# EAGLE design resonant-bpf-rev3 (EAGLE 7.7.0)
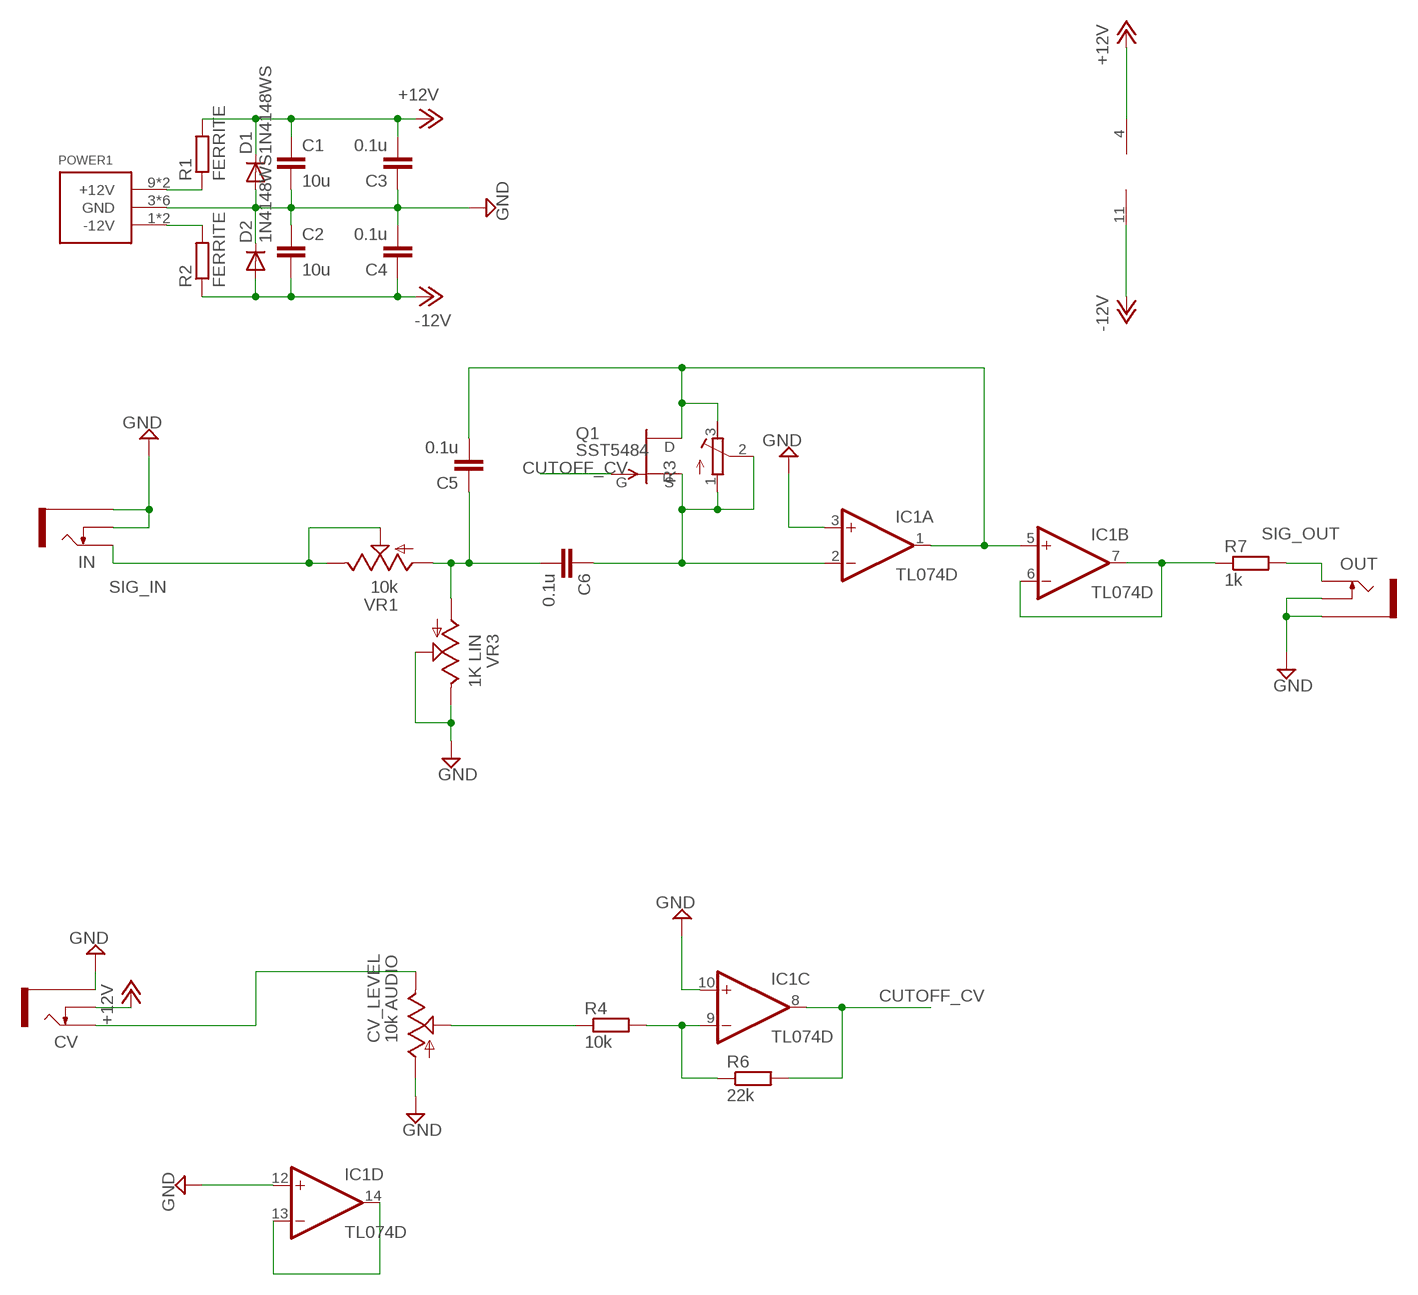
[diagram p0: schematic, sheet 1]

## Parts
C1  10u  C-EUC0805  [C0805]
C2  10u  C-EUC0805  [C0805]
C3  0.1u  C-EUC0805  [C0805]
C4  0.1u  C-EUC0805  [C0805]
C5  0.1u  C-EUC0805  [C0805]
C6  0.1u  C-EUC0805  [C0805]
CV  THONKICONNNEW  [WQP-PJ301M-12_JACK]
CV_LEVEL  10k AUDIO  9MM_SNAP-IN_POT_  [9MM_SNAP-IN_POT]
D1  1N4148WS  DIODE-SOD323-W  [SOD323-W]
D2  1N4148WS  DIODE-SOD323-W  [SOD323-W]
IC1  TL074D  [SO14]
IN  THONKICONNNEW  [WQP-PJ301M-12_JACK]
OUT  THONKICONNNEW  [WQP-PJ301M-12_JACK]
POWER1  POWER_SIMPLE10  [POWER_10]
Q1  SST5484  [SOT23]
R1  FERRITE  R-EU_R0805  [R0805]
R2  FERRITE  R-EU_R0805  [R0805]
R3  R-TRIMM3296W  [RTRIM3296W]
R4  10k  R-EU_R0805  [R0805]
R6  22k  R-EU_R0805  [R0805]
R7  1k  R-EU_R0805  [R0805]
VR1  10k  9MM_SNAP-IN_POT_  [9MM_SNAP-IN_POT]
VR3  1K LIN  9MM_SNAP-IN_POT_  [9MM_SNAP-IN_POT]

## Nets
+12V: C1.1 C3.2 CV.P$2_SWITCH(SWITCH) D1.C IC1.4(P:V+) R1.2
-12V: C2.2 C4.1 D2.A IC1.11(P:V-) R2.1
CUTOFF_CV: IC1.8(C:OUT) Q1.3(G) R6.2
GND: C1.2 C2.1 C3.1 C4.2 CV.P$3_SLEEVE(SLEEVE) CV_LEVEL.1(A) D1.A D2.C IC1.3(A:+IN) IC1.10(C:+IN) IC1.12(D:+IN) IN.P$2_SWITCH(SWITCH) IN.P$3_SLEEVE(SLEEVE) OUT.P$2_SWITCH(SWITCH) OUT.P$3_SLEEVE(SLEEVE) POWER1.3(GND) POWER1.4(GND) POWER1.5(GND) POWER1.6(GND) POWER1.7(GND) POWER1.8(GND) VR3.2(S) VR3.3(E)
N$1: C5.1 C6.2 VR1.1(A) VR3.1(A)
N$2: POWER1.1(-12V) POWER1.2(-12V) R2.2
N$3: POWER1.9(+12V) POWER1.10(+12V) R1.1
N$4: C5.2 IC1.1(A:OUT) IC1.5(B:+IN) Q1.1(D) R3.3(E)
N$5: C6.1 IC1.2(A:-IN) Q1.2(S) R3.1(A) R3.2(S)
N$6: CV.P$1_TIP(TIP) CV_LEVEL.3(E)
N$7: CV_LEVEL.2(S) R4.1
N$8: IC1.9(C:-IN) R4.2 R6.1
N$9: IC1.6(B:-IN) IC1.7(B:OUT) R7.1
N$10: IC1.13(D:-IN) IC1.14(D:OUT)
SIG_IN: IN.P$1_TIP(TIP) VR1.2(S) VR1.3(E)
SIG_OUT: OUT.P$1_TIP(TIP) R7.2

## Library data of the parts
C1-C6 = rcl:C-EU: CAPACITOR, European symbol
CV IN OUT = MusicThingModular:THONKICONN: 3.5mm socket for Eurorack modular synths
CV_LEVEL VR1 VR3 = MusicThingModular:9MM_SNAP-IN_POT: 9mm vertical snap-in pot, Alpha / Panasonic style
D1 D2 = diode:DIODE-: DIODE
IC1 = linear:TL074: OP AMP
POWER1 = eurorack:POWER_SIMPLE
Q1 = transistor-fet:?548*: N-Channel JFETs Source: VISHAY 2N5484.pdf Compatible: TO92 2N5245 J304 J305 U310 J308 J309 J310 TO72 2N4416 2N4416A 2N3823 2N4351 3N169 3N170 3N171 MFE3002 TO18 2N3796 2N3797 MFE825 Source: Motorola European Master Guide Pacge 3-59
R1 R2 R4 R6 R7 = rcl:R-EU_: RESISTOR, European symbol
R3 = rcl:R-TRIMM: Trimm resistor

## Board
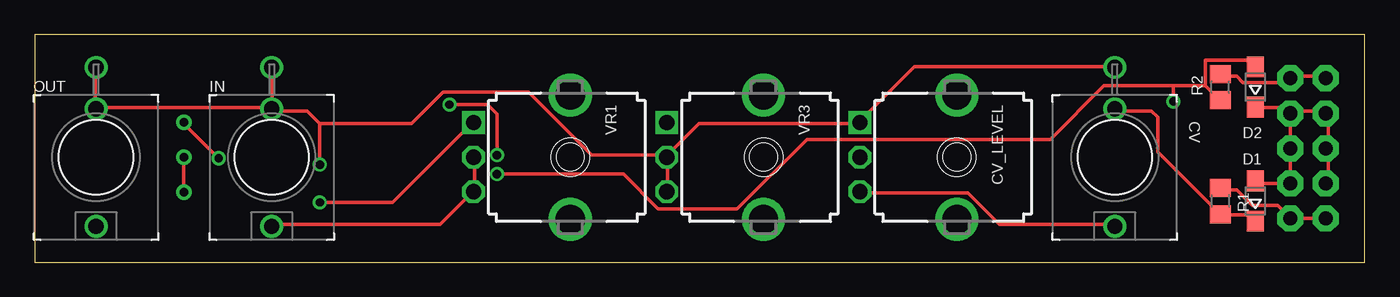
[diagram p1: board, top side]
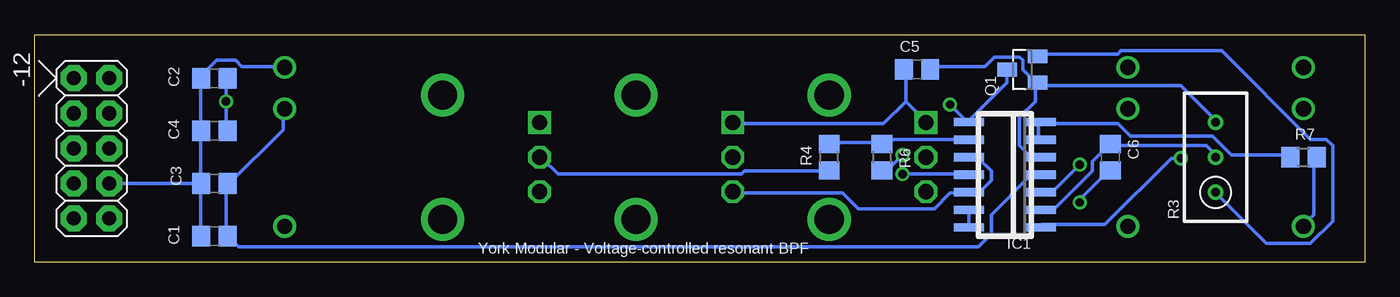
[diagram p2: board, bottom side, seen from below]

Size 96.19 x 16.5 mm. Coordinates in mm from the lower left corner, seen from the top.
Outline: 0,0 96.19,0 96.19,16.5 0,16.5 0,0
Copper layers (1*16): Top 0.035mm / dielectric 1.5mm / Bottom 0.035mm
Design rules "default": minimum track width 10mil, minimum drill 24mil, track to track 8mil, track to pad 8mil, pad to pad 8mil, via to via 8mil, smd to smd 8mil, copper to edge 40mil, drill to drill 8mil, minimum pad ring 10mil, minimum via ring 8mil, stop-mask expansion 4mil, vias tented up to drill 0mil, thermal gap 10mil

### Footprints (pad centres in the part's own frame; a part is rotated, then mirrored left to right if it is on the bottom)
C0805 = smd 1.3 x 1.5: 1 -0.95,0; 2 0.95,0
WQP-PJ301M-12_JACK = drill 1.1: P$1_TIP 0,5; P$2_SWITCH 0,-3.5; P$3_SLEEVE 0,-6.5
9MM_SNAP-IN_POT = drill 1.1 square: 1 -2.5,-7 | drill 1.1 octagon: 2 0,-7; 3 2.5,-7 | drill 2.1 pad 2.794: CHASSIS1 -4.5,0; CHASSIS2 4.5,0
SOD323-W = smd 1.5 x 1.2: A 1.45,0; C -1.45,0
SO14 = smd 0.6 x 2.2: 1 -3.81,-2.6; 2 -2.54,-2.6; 3 -1.27,-2.6; 4 0,-2.6; 5 1.27,-2.6; 6 2.54,-2.6; 7 3.81,-2.6; 8 3.81,2.6; 9 2.54,2.6; 10 1.27,2.6; 11 0,2.6; 12 -1.27,2.6; 13 -2.54,2.6; 14 -3.81,2.6
POWER_10 = drill 1.016 pad 1.88 octagon: 1 -5.08,-1.27; 2 -5.08,1.27; 3 -2.54,-1.27; 4 -2.54,1.27; 5 0,-1.27; 6 0,1.27; 7 2.54,-1.27; 8 2.54,1.27; 9 5.08,-1.27; 10 5.08,1.27
SOT23 = smd 1 x 1.4: 1 -0.95,-1.1; 2 0.95,-1.1; 3 0,1.1
R0805 = smd 1.3 x 1.5: 1 -0.95,0; 2 0.95,0
RTRIM3296W = drill 0.61: 1 0,-2.54; 2 0,0; 3 0,2.54

### Placement (x,y rotation side)
C1  83.18,1.91 180 bottom
C2  83.18,13.34 0 bottom
C3  83.18,5.71 0 bottom
C4  83.18,9.53 180 bottom
C5  32.39,13.97 0 bottom
C6  18.41,7.62 270 bottom
CV  78.1,7.62 180 top
CV_LEVEL  66.67,7.62 270 top
D1  88.27,4.45 90 top
D2  88.27,12.7 90 top
IC1  26.04,6.35 90 bottom
IN  17.14,7.62 180 top
OUT  4.45,7.62 180 top
POWER1  92.07,8.26 270 bottom
Q1  24.76,13.97 90 bottom
R1  85.72,4.45 270 top
R2  85.72,12.7 90 top
R3  10.79,7.62 0 bottom
R4  38.73,7.62 90 bottom
R6  34.93,7.62 270 bottom
R7  4.45,7.62 0 bottom
VR1  38.73,7.62 270 top
VR3  52.71,7.62 270 top

### Tracks (layer width: path | path; a pad name or v marks a point on that pad's centre or on a via)
+12V
  Top 0.254: D1.C 88.06,3.2 87.83,3.43 85.78,3.43 R1.2 85.55,3.66 81.2,8 81.2,10.52 80.75,10.97 78.23,10.97 CV.P$2_SWITCH
  Bottom 0.254: IC1.4 23.6,6.17 24.28,6.17 27.03,3.43 27.03,2.06 27.94,1.14 81.43,1.14 82.12,1.83 C1.1 82.35,2.06 82.35,5.71 C3.2 82.12,5.71 78.23,9.6 78.23,10.97 CV.P$2_SWITCH
-12V  (via drill 0.61)
  Top 0.254: 84.63,12.8 85.55,11.89 R2.1 | 84.63,12.8 84.63,14.63 87.6,14.63 88.06,14.17 D2.A | v33.43,6.4 42.57,6.4 45.09,3.89 50.8,3.89 55.83,8.91 73.43,8.91 77.32,12.8 82.35,12.8 | 84.63,12.8 82.35,12.8 | 82.35,12.8 v82.35,11.66
  Bottom 0.254: C4.1 82.35,9.6 v82.35,11.66 82.35,13.26 C2.2 | v33.43,6.4 28.85,6.4 IC1.11
CUTOFF_CV  (via drill 0.61)
  Top 0.254: v33.43,7.77 33.43,10.74 32.74,11.43 v30,11.43
  Bottom 0.254: Q1.3 25.88,13.95 25.88,13.03 28.63,10.29 IC1.8 28.85,10.29 v30,11.43 | v33.43,7.77 34.34,6.86 34.8,6.86 R6.2
GND  (via drill 0.61)
  Top 0.254: POWER1.7 93.55,5.71 93.55,8.23 POWER1.5 93.55,8.46 93.55,10.74 POWER1.3 93.32,10.97 90.8,10.97 | D1.A 88.29,5.71 POWER1.8 POWER1.6 POWER1.4 90.8,10.97 | 90.8,10.97 90.58,11.2 88.29,11.2 D2.C | OUT.P$3_SLEEVE 4.39,13.95 4.39,11.2 OUT.P$2_SWITCH 4.62,11.2 16.97,11.2 IN.P$2_SWITCH | 20.62,10.06 v20.62,7.09 | 20.62,10.06 19.71,10.97 17.2,10.97 IN.P$2_SWITCH | IN.P$3_SLEEVE 17.2,13.95 17.2,11.2 IN.P$2_SWITCH | VR3.2 45.77,7.54 45.77,5.26 VR3.3 | VR3.2 45.77,7.77 48.06,10.06 59.49,10.06 CV_LEVEL.1 59.72,10.29 63.6,14.17 78,14.17 CV.P$3_SLEEVE | 20.62,10.06 27.25,10.06 29.54,12.34 35.71,12.34 40.28,7.77 45.54,7.77 VR3.2
  Bottom 0.254: 84.18,5.71 84.18,2.06 C1.2 | 84.18,5.71 84.18,9.37 C4.2 84.18,9.6 84.18,13.26 C2.1 84.18,13.49 83.03,14.63 81.66,14.63 81.2,14.17 78.23,14.17 CV.P$3_SLEEVE | 84.18,5.71 POWER1.8 | 84.18,5.71 C3.1 | v20.62,7.09 22.45,5.26 23.37,5.26 IC1.3 | IC1.10 28.63,7.54 27.94,7.54 27.03,6.63 27.03,5.94 27.71,5.26 28.63,5.26 IC1.12 28.85,5.03 30,5.03 31.14,3.89 36.63,3.89 37.77,5.03 45.54,5.03 VR3.3
N$1  (via drill 0.61)
  Top 0.254: v20.62,4.34 25.88,4.34 31.6,10.06 VR1.1
  Bottom 0.254: v20.62,4.34 20.62,4.57 18.57,6.63 C6.2 | 33.2,11.66 33.2,13.95 C5.1 | 33.2,11.66 31.83,10.29 VR1.1 | 33.2,11.66 34.8,10.06 45.54,10.06 VR3.1
N$2
  Top 0.254: R2.2 85.78,13.49 86.92,13.49 87.38,13.03 90.58,13.03 90.8,13.26 POWER1.2 90.8,13.49 93.32,13.49 POWER1.1
N$3
  Top 0.254: 90.8,3.2 89.89,4.12 88.06,4.12 86.92,5.26 85.78,5.26 R1.1 | 90.8,3.2 93.32,3.2 POWER1.9 | 90.8,3.2 POWER1.10
N$4  (via drill 0.61)
  Top 0.254: v13.31,7.54 10.79,10.06 R3.3
  Bottom 0.254: Q1.1 23.82,12.8 23.82,11.66 24.97,10.52 24.97,8.46 24.28,7.77 23.6,7.77 IC1.5 | C5.2 31.37,14.17 27.48,14.17 26.8,14.86 24.97,14.86 24.74,14.63 24.74,13.95 23.82,13.03 Q1.1 | v13.31,7.54 14,7.54 18.8,2.74 23.37,2.74 IC1.1 | Q1.1 23.6,12.8 13.31,12.8 10.79,10.29 R3.3
N$5
  Top 0.254: R3.1 R3.2
  Bottom 0.254: R3.2 10.79,7.77 11.48,8.46 18.34,8.46 C6.1 18.57,8.46 19.71,7.32 19.71,6.63 22.45,3.89 23.37,3.89 IC1.2 | Q1.2 23.6,15.09 17.88,15.09 17.65,15.32 10.34,15.32 3.94,8.91 2.79,8.91 2.34,8.46 2.34,2.97 3.94,1.37 7.14,1.37 10.79,5.03 R3.1
N$6
  Top 0.254: CV.P$1_TIP 78,2.74 69.77,2.74 67.49,5.03 59.72,5.03 CV_LEVEL.3
N$7
  Bottom 0.254: R4.1 38.91,6.63 44.86,6.63 45.09,6.4 58.34,6.4 59.49,7.54 CV_LEVEL.2
N$8
  Bottom 0.254: R4.2 38.68,8.69 35.03,8.69 R6.1 34.8,8.69 34.57,8.91 28.85,8.91 IC1.9
N$9
  Bottom 0.254: R7.1 5.54,7.77 9.65,7.77 11.02,9.14 16.97,9.14 17.88,10.06 23.37,10.06 IC1.7 23.6,10.06 23.6,8.91 IC1.6
N$10
  Bottom 0.254: IC1.14 28.63,2.74 28.63,3.66 IC1.13
SIG_IN
  Top 0.254: IN.P$1_TIP 17.2,2.74 29.31,2.74 31.6,5.03 VR1.3 31.83,5.26 31.83,7.54 VR1.2
SIG_OUT
  Bottom 0.254: R7.2 3.71,7.54 3.71,3.43 4.39,2.74 OUT.P$1_TIP

### Text on the board
bNames: York Modular - Voltage-controlled resonant BPF